# EAGLE design DS2782 (EAGLE 7.3.0)
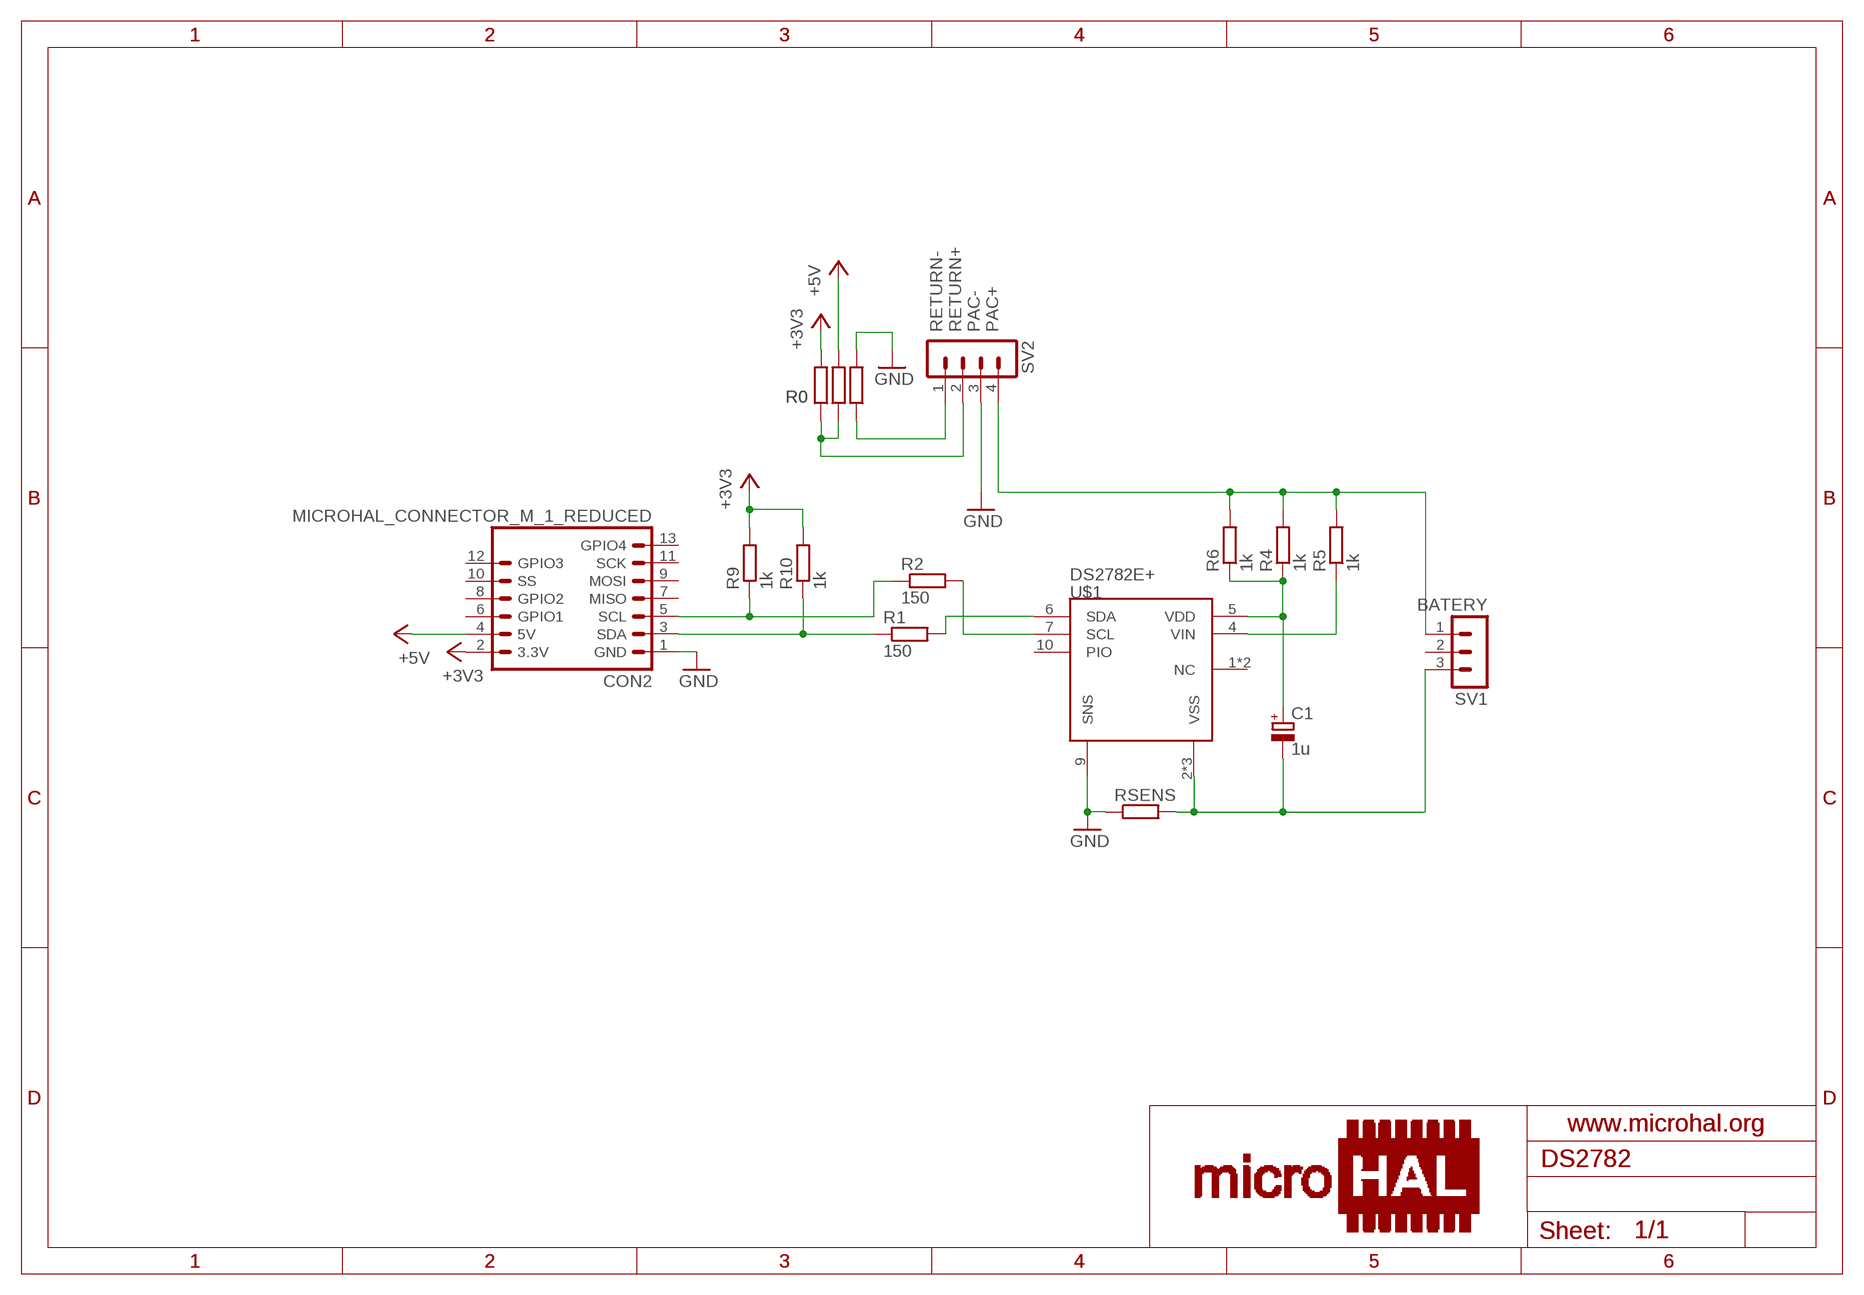
[diagram p0: schematic, sheet 1]

## Parts
C1  1u  CPOL-EU153CLV-0405  [153CLV-0405]
CON2  MICROHAL_CONNECTOR_M_1_REDUCED  [MICROHAL_CONNECTOR_M_1_REDUCED_EDGE]
R1  150  R-EU_R0603  [R0603]
R2  150  R-EU_R0603  [R0603]
R3  R-EU_R0603  [R0603]
R4  1k  R-EU_R0603  [R0603]
R5  1k  R-EU_R0603  [R0603]
R6  1k  R-EU_R0603  [R0603]
R7  R-EU_R0603  [R0603]
R8  R-EU_R0603  [R0603]
R9  1k  R-EU_R0603  [R0603]
R10  1k  R-EU_R0603  [R0603]
RSENS  R-EU_R1206  [R1206]
SV1  BATERY  MA03-1  [MA03-1]
SV2  MA04-1  [MA04-1]
U$1  DS2782E+  [TDFN-10]

## Nets
+3V3: CON2.2(3.3V) R8.2 R9.2 R10.2
+5V: CON2.4(5V) R7.2
GND: CON2.1(GND) R3.2 RSENS.1 SV2.3 U$1.9(SNS)
N$1: R1.2 U$1.6(SDA)
N$2: R2.2 U$1.7(SCL)
N$3: CON2.3(SDA) R1.1 R10.1
N$5: C1.+ R4.1 R6.1 U$1.5(VDD)
N$6: R5.1 U$1.4(VIN)
N$7: C1.- RSENS.2 SV1.3 U$1.2(VSS) U$1.3(VSS) U$1.PAD1(VSS)
N$9: R4.2 R5.2 R6.2 SV1.1 SV2.4
N$11: R7.1 R8.1 SV2.2
N$12: CON2.5(SCL) R2.1 R9.1
N$13: R3.1 SV2.1
Unconnected: CON2.6(GPIO1) CON2.7(MISO) CON2.8(GPIO2) CON2.9(MOSI) CON2.10(SS) CON2.11(SCK) CON2.12(GPIO3) CON2.13(GPIO4) SV1.2 U$1.1(NC) U$1.8(NC) U$1.10(PIO)

## Notes on the sheet
- RETURN-
  RETURN+
  PAC-
  PAC+
- R0 | R0

## Library data of the parts
C1 = rcl:CPOL-EU: POLARIZED CAPACITOR, European symbol
CON2 = microhal-connector_v0.1:MICROHAL_CONNECTOR_M_1_REDUCED
R1-R10 RSENS = rcl:R-EU_: RESISTOR, European symbol
SV1 = con-lstb:MA03-1: PIN HEADER; OC_FARNELL: unknown; OC_NEWARK: unknown
SV2 = con-lstb:MA04-1: PIN HEADER; OC_FARNELL: unknown; OC_NEWARK: unknown
U$1 = DS2782:DS2782E+

## Board
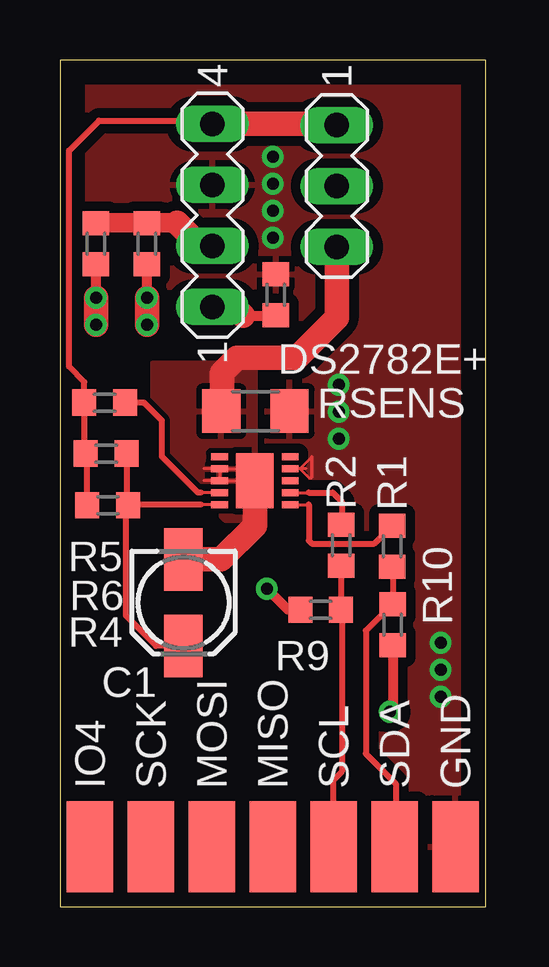
[diagram p1: board, top side]
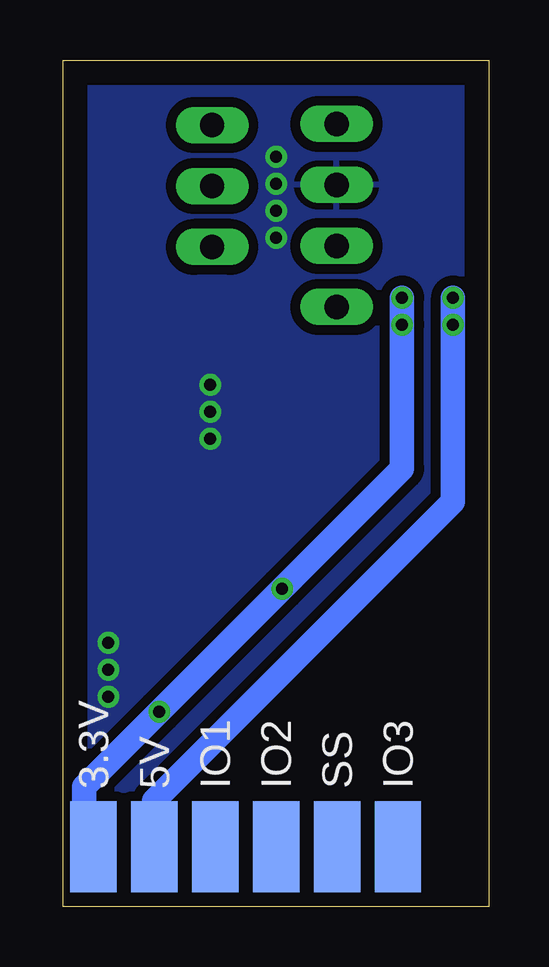
[diagram p2: board, bottom side, seen from below]

Size 17.75 x 35.28 mm. Coordinates in mm from the lower left corner, seen from the top.
Outline: 0,0 17.75,0 17.75,35.28 0,35.28 0,0
Copper layers (1*16): Top 0.035mm / dielectric 1.5mm / Bottom 0.035mm
Design rules "default": minimum track width 10mil, minimum drill 24mil, track to track 8mil, track to pad 8mil, pad to pad 8mil, via to via 8mil, smd to smd 8mil, copper to edge 40mil, drill to drill 8mil, minimum pad ring 10mil, minimum via ring 8mil, stop-mask expansion 4mil, vias tented up to drill 0mil, thermal gap 10mil

### Footprints (pad centres in the part's own frame; a part is rotated, then mirrored left to right if it is on the bottom)
153CLV-0405 = smd 2.6 x 1.6: + 1.8,0; - -1.8,0
MICROHAL_CONNECTOR_M_1_REDUCED_EDGE = smd 1.93 x 3.81 bottom: 1 -7.62,0; 3 -5.08,0; 5 -2.54,0; 7 0,0; 9 2.54,0; 11 5.08,0; 13 7.62,0 | smd 1.93 x 3.81: 2 -7.62,0; 4 -5.08,0; 6 -2.54,0; 8 0,0; 10 2.54,0; 12 5.08,0
R0603 = smd 1 x 1.1: 1 -0.85,0; 2 0.85,0
R1206 = smd 1.6 x 1.803: 1 -1.422,0; 2 1.422,0
MA03-1 = drill 1.016 long: 1 -2.54,0; 2 0,0; 3 2.54,0
MA04-1 = drill 1.016 long: 1 -3.81,0; 2 -1.27,0; 3 1.27,0; 4 3.81,0
TDFN-10 = smd 0.7 x 0.3: 1 -1.475,1; 2 -1.475,0.5; 3 -1.475,0; 4 -1.475,-0.5; 5 -1.475,-1; 6 1.475,-1; 7 1.475,-0.5; 8 1.475,0; 9 1.475,0.5; 10 1.475,1 | smd 1.58 x 2.3: PAD1 0,0

### Placement (x,y rotation side)
C1  5.15,12.67 270 top
CON2  8.88,2.5 0 bottom
R1  13.86,15.02 90 top
R2  11.73,15.06 90 top
R3  9,25.5 90 top
R4  2,16.73 180 top
R5  1.86,21 180 top
R6  1.93,18.88 180 top
R7  1.5,27.62 270 top
R8  3.62,27.62 270 top
R9  10.88,12.38 180 top
R10  13.88,11.75 270 top
RSENS  8.15,20.65 180 top
SV1  11.54,30.03 270 top
SV2  6.36,28.8 90 top
U$1  8.12,17.75 0 top

### Tracks (layer width: path | path; a pad name or v marks a point on that pad's centre or on a via)
+3V3  (via drill 0.5)
  Top 0.406: 3.62,25.25 R8.2 | R10.2 13.88,8.25 v13.75,8.12 | R9.2 9.5,12.38 v8.62,13.25
  Top 1.016: v3.62,25.38 3.62,25.25 v3.62,24.25
  Bottom 1.016: CON2.2 16.62,2.5 16.88,2.75 16.88,5 v13.75,8.12 v8.62,13.25 3.62,18.25 v3.62,24.25 v3.62,25.38
+5V  (via drill 0.5)
  Top 0.406: v1.5,24.25 R7.2
  Top 1.016: v1.5,25.38 v1.5,24.25
  Bottom 1.016: CON2.4 13.96,4.42 1.5,16.88 v1.5,24.25 v1.5,25.38
GND  (via drill 0.5)
  Top 0.128: 10,18.25 U$1.9 | 10,18.25 10.38,17.88 10.5,17.88 10.5,18.75 10,18.25 | 10.25,18.25 10,18.25
  other vias: 8.88,31.25 8.88,29 8.88,30.12 8.88,27.88 11.62,21.75 11.62,20.62 11.62,19.5 15.88,11 15.88,9.88 15.88,8.75
  pour Top (isolate 0.406): 8.88,2.5 17.75,2.5 17.75,2.75 17.75,34.12 0,34.12 0,23.5 8.62,23.5 8.62,14.5 8.62,2.62 8.62,2.5
  pour Bottom (isolate 0.406): 8.88,2.5 17.75,2.5 17.75,5.62 17.75,34.12 0,34.12 0,4.25 0,2.5
N$1
  Top 0.128: U$1.6 10.38,16.75
  Top 0.254: 10.38,16.75 10.38,15.25 10.5,15.12 13.11,15.12 R1.2
N$2
  Top 0.128: U$1.7 10.38,17.25
  Top 0.254: 10.38,17.25 11.38,17.25 11.75,16.88 11.75,15.94 R2.2
N$3
  Top 0.254: R1.1 13.88,14.17 R10.1 14,12.6 14,12.62 13.88,12.62 12.75,11.5 12.75,6.38 14,5.12 14,2.54 CON2.3
N$4
  Top 0.254: 6.5,2.5 6.38,2.5
N$5
  Top 0.128: U$1.5 5.88,16.75
  Top 0.254: C1.+ 4,10.87 2.75,12.12 2.75,16.64 R4.1 | R6.1 2.77,16.8 R4.1 | 5.88,16.75 2.87,16.75 R4.1
N$6
  Top 0.128: U$1.4 5.88,17.25
  Top 0.254: 5.88,17.25 5.75,17.25 4.25,18.75 4.25,20.25 3.5,21 R5.1
N$7
  Top 0.128: U$1.3 U$1.PAD1 7.62,18.25 U$1.2 | U$1.2 U$1.3 | U$1.3 6,17.75 | U$1.2 6,18.25
  Top 1.016: SV1.3 11.54,24.55 9.88,22.88 7.38,22.88 6.75,22.25 6.75,20.67 RSENS.2 | C1.- 6.72,14.47 8.12,15.88 U$1.PAD1
  pour Top: 8.12,16.12 8.12,22.62 3.88,22.62 3.88,19.25 6.88,16.12
N$9
  Top 0.254: R4.2 1.15,18.81 R6.2 1.01,18.94 R5.2 1.01,21.86 0.38,22.5 0.38,31.5 1.62,32.75 6.22,32.75 SV2.4
  Top 1.016: SV2.4 11.5,32.62 SV1.1
N$11
  Top 0.813: 3.65,28.5 1.52,28.5 R7.1 | 4.88,28.5 3.65,28.5 | 3.65,28.5 R8.1
  Top 1.016: SV2.2 5.84,27.54 4.88,28.5
N$12
  Top 0.254: R2.1 11.75,14.21 11.75,14.25 11.72,14.25 R9.1 11.75,12.38 11.75,5.62 11.38,5.25 11.38,2.54 CON2.5
N$13
  Top 0.406: 7.62,24.62 8.97,24.62 R3.1
  Top 1.016: SV2.1 7.25,25 7.62,24.62
N$15
  Top 0.254: 11.38,2.5 11.5,2.5

### Text on the board
tTest: BAT- / / TEMP / / BAT+
bTest: RETU- / / RETU+ / / PACK- / / PACK+